# EAGLE design SparkFun_Interactive_Badge (EAGLE 7.2.0)
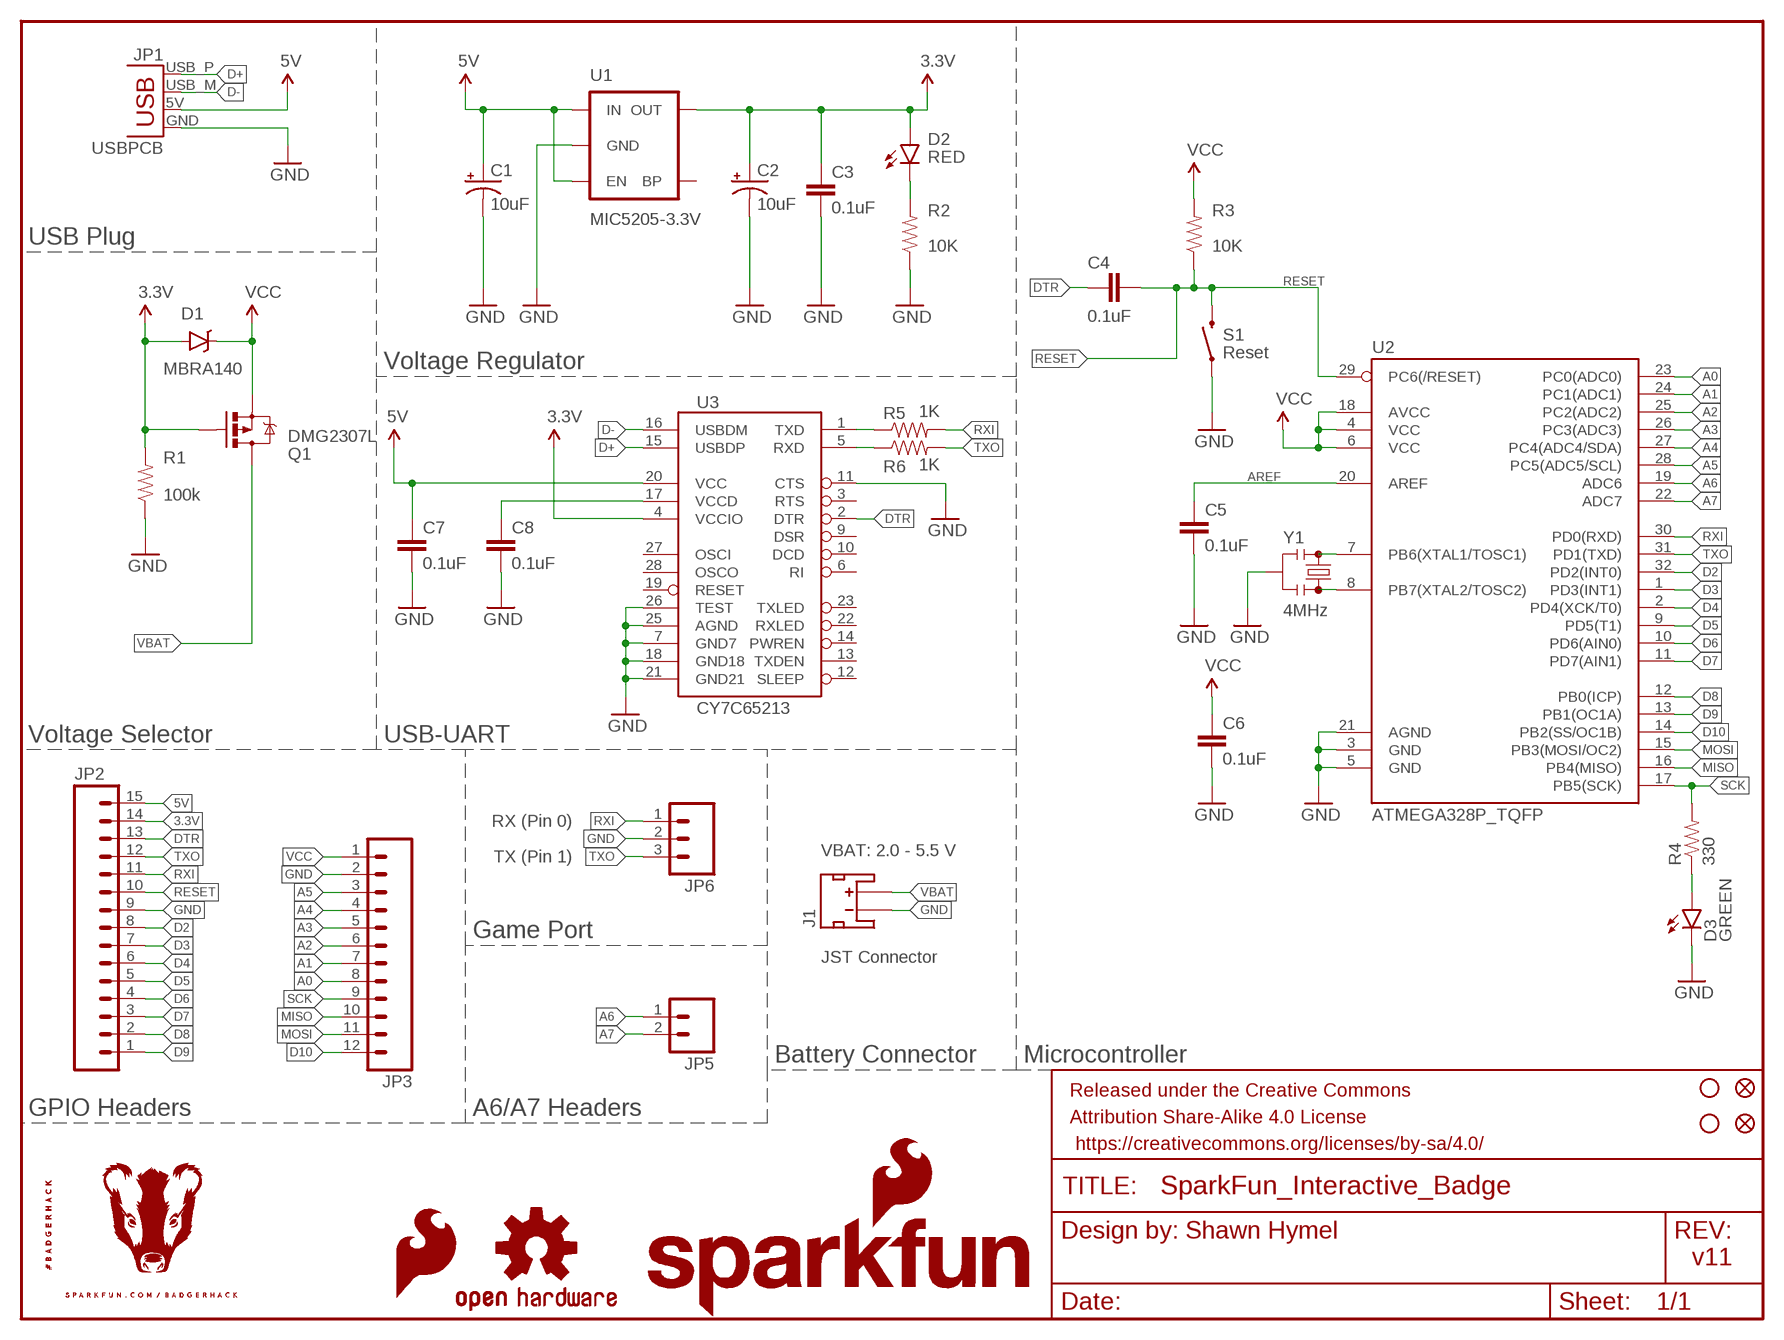
[diagram p0: schematic, sheet 1]

## Parts
C1  10uF  10UF-16V-10%(TANT)  [EIA3216]
C2  10uF  10UF-16V-10%(TANT)  [EIA3216]
C3  0.1uF  0.1UF-25V(+80/-20%)(0603)  [0603-CAP]
C4  0.1uF  0.1UF-25V(+80/-20%)(0603)  [0603-CAP]
C5  0.1uF  0.1UF-25V(+80/-20%)(0603)  [0603-CAP]
C6  0.1uF  0.1UF-25V(+80/-20%)(0603)  [0603-CAP]
C7  0.1uF  0.1UF-25V(+80/-20%)(0603)  [0603-CAP]
C8  0.1uF  0.1UF-25V(+80/-20%)(0603)  [0603-CAP]
D1  MBRA140  DIODE-SCHOTTKY-MBRA140  [SMA-DIODE]
D2  RED  LED-RED0603  [LED-0603]
D3  GREEN  LED-GREEN0603  [LED-0603]
FID1  FIDUCIAL1X2  [FIDUCIAL-1X2]
FID2  FIDUCIAL1X2  [FIDUCIAL-1X2]
FRAME1  FRAME-LETTER  [CREATIVE_COMMONS]
J1  JST_2MM_MALE  [JST-2-SMD]
JP1  USBPCB  [USB-A-PCB]
JP2  M15LOCK_NO_SILK  [1X15_LOCK_NO_SILK]
JP3  M12LOCK_NO_SILK  [1X12_LOCK_NO_SILK]
JP5  M021X02_NO_SILK  [1X02_NO_SILK]
JP6  M03LOCK Female  M03LOCK_NO_SILK  [1X03_LOCK_NO_SILK]
LOGO1  SFE_LOGO_FLAME.1_INCH  [SFE_LOGO_FLAME_.1]
LOGO2  OSHW-LOGOS  [OSHW-LOGO-S]
Q1  DMG2307L  MOSFET-PCHANNELDMG2307L  [SOT23-3]
R1  100k  100KOHM-1/10W-1%(0603)  [0603-RES]
R2  10K  10KOHM-1/10W-1%(0603)0603  [0603-RES]
R3  10K  10KOHM-1/10W-1%(0603)0603  [0603-RES]
R4  330  330OHM1/10W1%(0603)  [0603-RES]
R5  1K  1KOHM-1/10W-1%(0603)  [0603-RES]
R6  1K  1KOHM-1/10W-1%(0603)  [0603-RES]
S1  SWITCH-MOMENTARY-2SMD-REDUNDANT  [TACTILE-SWITCH-SMD]
STANDOFF1  STAND-OFF  [STAND-OFF]
STANDOFF2  STAND-OFF  [STAND-OFF]
U1  MIC5205-3.3V  MIC52053.3V  [SOT23-5]
U2  ATMEGA328P_TQFP  [TQFP32-08]
U3  CY7C65213  [SSOP28DB]
U$1  SFE_LOGO_NAME_FLAME.1_INCH  [SFE_LOGO_NAME_FLAME_.1]
U$2  BADGERHACK_LOGODUMMY  [DUMMY]
Y1  4MHz  RESONATOR4MHZ  [RESONATOR-SMD_MED]

## Nets
3.3V: C2.A(+) C3.1 D1.A D2.A JP2.14 Q1.1(G) R1.2 U1.5(OUT) U3.4(VCCIO)
5V: C1.A(+) C7.1 JP1.5V(VBUS) JP2.15 U1.1(IN) U1.3(EN) U3.20(VCC)
A0: JP3.8 U2.23(PC0(ADC0))
A1: JP3.7 U2.24(PC1(ADC1))
A2: JP3.6 U2.25(PC2(ADC2))
A3: JP3.5 U2.26(PC3(ADC3))
A4: JP3.4 U2.27(PC4(ADC4/SDA))
A5: JP3.3 U2.28(PC5(ADC5/SCL))
A6: JP5.1 U2.19(ADC6)
A7: JP5.2 U2.22(ADC7)
AREF: C5.1 U2.20(AREF)
D2: JP2.8 U2.32(PD2(INT0))
D3: JP2.7 U2.1(PD3(INT1))
D4: JP2.6 U2.2(PD4(XCK/T0))
D5: JP2.5 U2.9(PD5(T1))
D6: JP2.4 U2.10(PD6(AIN0))
D7: JP2.3 U2.11(PD7(AIN1))
D8: JP2.2 U2.12(PB0(ICP))
D9: JP2.1 U2.13(PB1(OC1A))
D10: JP3.12 U2.14(PB2(SS/OC1B))
D+: JP1.USB_P(D+) U3.15(USBDP)
D-: JP1.USB_M(D-) U3.16(USBDM)
DTR: C4.1 JP2.13 U3.2(DTR)
GND: C1.C(-) C2.C(-) C3.2 C5.2 C6.2 C7.2 C8.2 D3.C J1.1(-) JP1.GND JP2.9 JP3.2 JP6.2 R1.1 R2.1 S1.1 S1.2 U1.2(GND) U2.3(GND) U2.5(GND) U2.21(AGND) U3.7(GND7) U3.11(CTS) U3.18(GND18) U3.21(GND21) U3.25(AGND) U3.26(TEST) Y1.2
MISO: JP3.10 U2.16(PB4(MISO))
MOSI: JP3.11 U2.15(PB3(MOSI/OC2))
N$1: D3.A R4.1
N$2: C8.1 U3.17(VCCD)
N$3: R5.1 U3.1(TXD)
N$4: D2.C R2.2
N$5: U2.7(PB6(XTAL1/TOSC1)) Y1.1
N$6: U2.8(PB7(XTAL2/TOSC2)) Y1.3
N$7: R6.1 U3.5(RXD)
RESET: C4.2 JP2.10 R3.1 S1.3 S1.4 U2.29(PC6(/RESET))
RXI: JP2.11 JP6.1 R5.2 U2.30(PD0(RXD))
SCK: JP3.9 R4.2 U2.17(PB5(SCK))
TXO: JP2.12 JP6.3 R6.2 U2.31(PD1(TXD))
VBAT: J1.2(+) Q1.3(D)
VCC: C6.1 D1.C JP3.1 Q1.2(S) R3.2 U2.4(VCC) U2.6(VCC) U2.18(AVCC)
Unconnected: J1.NC1(PAD1) J1.NC2(PAD2) U1.4(BP) U3.3(RTS) U3.6(RI) U3.9(DSR) U3.10(DCD) U3.12(SLEEP) U3.13(TXDEN) U3.14(PWREN) U3.19(RESET) U3.22(RXLED) U3.23(TXLED) U3.27(OSCI) U3.28(OSCO)

## Notes on the sheet
- USB Plug
- Voltage Regulator
- Voltage Selector | USB-UART
- RX (Pin 0)
- TX (Pin 1) | VBAT: 2.0 - 5.5 V
- Game Port
- JST Connector
- Battery Connector | Microcontroller
- GPIO Headers | A6/A7 Headers

## Library data of the parts
C1 C2 = SparkFun-Capacitors:10UF-16V-10%(TANT): CAP-00811 1206/EIA-3216 Tantalum capacitor; PROD_ID: CAP-00811
C3-C8 = SparkFun-Capacitors:0.1UF-25V(+80/-20%)(0603): CAP-00810 Ceramic Standard decoupling cap; PROD_ID: CAP-00810
D1 = SparkFun-DiscreteSemi:DIODE-SCHOTTKY: Schottky diodes in SFE's production catalog BAT20J 1A 23V 0.62Vf RB751 120mA 40V 0.37Vf PMEG4005EJ 0.5A 40V 0.42Vf MBRA140 1A 40V 0.5Vf B340A 3A 40V SMA; PROD_ID: DIO-08053
D2 = SparkFun-LED:LED-RED: Assorted Red LEDs LilyPad 1206- DIO-09912 1206- DIO-00809 0603- DIO-00819 "SMART" means more efficient and expensive; PROD_ID: DIO-00819
D3 = SparkFun-LED:LED-GREEN: Various green LEDs Green LEDs used in SFE Production 0603- DIO-00821 LARGE- DIO-00862 LILYPAD- DIO-09910; PROD_ID: DIO-00821
FID1 FID2 = SparkFun-Aesthetics:FIDUCIAL: Fiducial Alignment Points Various fiducial points for machine vision alignment.
FRAME1 = SparkFun-Aesthetics:FRAME-LETTER: Schematic Frame Standard 8.5x11 US Letter frame; DESIGNER: Shawn Hymel; VERSION: v11
J1 = SparkFun-Connectors:JST_2MM_MALE: Mates to single-cell LiPo batteries. CONN-11443 Now with smashable polarity marks!; BTM_NEG: -; BTM_POS: +; PROD_ID: CONN-11443; TOP_NEG: -; TOP_POS: +
JP1 = SparkFun-Connectors:USB: USB Connectors USB-B-PTH is fully proven SKU : PRT-00139/CONN-08278 USB-miniB is fully proven SKU : PRT-00587 USB-A-PCB is untested. USB-A-H is throughly reviewed, but untested. Spark Fun Electronics SKU : PRT-00437 USB-B-SMT is throughly reviewed, but untested. Needs silkscreen touching up. USB-A-S has not been used/tested USB-MB-H has not been used/tested USB-MICROB has been used. CONN-09505
JP2 = SparkFun-Connectors:M15: Header 15 Standard 15-pin 0.1" header. Use with straight break away headers (SKU : PRT-00116), right angle break away headers (PRT-00553), swiss pins (PRT-00743), machine pins (PRT-00117), and female headers (PRT-00115).
JP3 = SparkFun-Connectors:M12: Header 12 Standard 12-pin 0.1" header. Use with straight break away headers (SKU : PRT-00116), right angle break away headers (PRT-00553), swiss pins (PRT-00743), machine pins (PRT-00117), and female headers (PRT-00115).
JP5 = SparkFun-Connectors:M02: Standard 2-pin 0.1" header. Use with - straight break away headers ( PRT-00116) - right angle break away headers (PRT-00553) - swiss pins (PRT-00743) - machine pins (PRT-00117) - female headers (PRT-00115) Molex polarized connector foot print use with: PRT-08233 with associated crimp pins and housings. 2.54_SCREWTERM for use with PRT-10571. 3.5mm Screw Terminal footprints for PRT-08084 5mm Screw Terminal footprints for use with PRT-08432
JP6 = SparkFun-Connectors:M03: Header 3 Standard 3-pin 0.1" header. Use with straight break away headers (SKU : PRT-00116), right angle break away headers (PRT-00553), swiss pins (PRT-00743), machine pins (PRT-00117), and female headers (PRT-00115). Molex polarized connector foot print use with SKU : PRT-08232 with associated crimp pins and housings.
LOGO1 = SparkFun-Aesthetics:SFE_LOGO_FLAME: SFE Logo, flame only This is the SparkFun flame logo. The logo on the schematic will always be the same size; the package variant is the height of the flame. Default layer for the logo on the board is tSilk.
LOGO2 = SparkFun-Aesthetics:OSHW-LOGO: Open Source Hardware Logo This logo indicates the piece of hardware it is found on incorporates a OSHW license and/or adheres to the definition of open source hardware found here: http://freedomdefined.org/OSHW
Q1 = SparkFun-DiscreteSemi:MOSFET-PCHANNEL: Generic PMOSFET IRLML2244 - TRANS-11153 (SOT-23 -20V -4.3A) (1.Gate 2.Source 3.Drain) FQP27P06 - COM-10349 <http://www.sparkfun.com/products/10349> (TO-220 -60V -27A) (1.Gate 2.Source 3.Drain); PROD_ID: TRANS-11308; VALUE: 2.5A/30V
R1 = SparkFun-Resistors:100KOHM-1/10W-1%(0603): RES-07828; PROD_ID: RES-07828
R2 R3 = SparkFun-Resistors:10KOHM-1/10W-1%(0603): RES-00824; PROD_ID: RES-00824
R4 = SparkFun-Resistors:330OHM1/10W1%(0603): RES-00818; PROD_ID: RES-00818
R5 R6 = SparkFun-Resistors:1KOHM-1/10W-1%(0603): RES-07856; PROD_ID: RES-07856
S1 = SparkFun-Electromechanical:SWITCH-MOMENTARY-2: Various NO switches- pushbuttons, reed, etc; FUNC: Reset; PROD_ID: SWCH-08247
STANDOFF1 STANDOFF2 = SparkFun-Electromechanical:STAND-OFF: #4 Stand Off This is the mechanical footprint for a #4 phillips button head screw. Use the keepout ring to avoid running the screw head into surrounding components. SKU : PRT-00447
U1 = SparkFun-PowerIC:MIC5205: MIC5205 150mA vreg 3.3V - VREG-00822 5V - VREG-00823; PROD_ID: VREG-00822
U2 = SparkFun-DigitalIC:ATMEGA328P_TQFP; PROD_ID: IC-09069
U3 = SparkFun-DigitalIC:CY7C65213: USB UART CY7C65213 USB-UART controller.; PROD_ID: IC-12487
U$1 = SparkFun-Aesthetics:SFE_LOGO_NAME_FLAME: SFE Logo, name and flame This is the SparkFun full logo. The logo on the schematic will always be the same size; the package variant is the height of the flame part of the logo. Default layer for the logo on the board is tSilk.
U$2 = SparkFun-Aesthetics:BADGERHACK_LOGO
Y1 = SparkFun-FreqCtrl:RESONATOR: Resonator Small SMD resonator. Used, eg, on the Arduino Pro/ Pro Mini boards. 8MHz- XTAL-08895 16MHz- XTAL-08900; PROD_ID: XTAL-12492

## Board
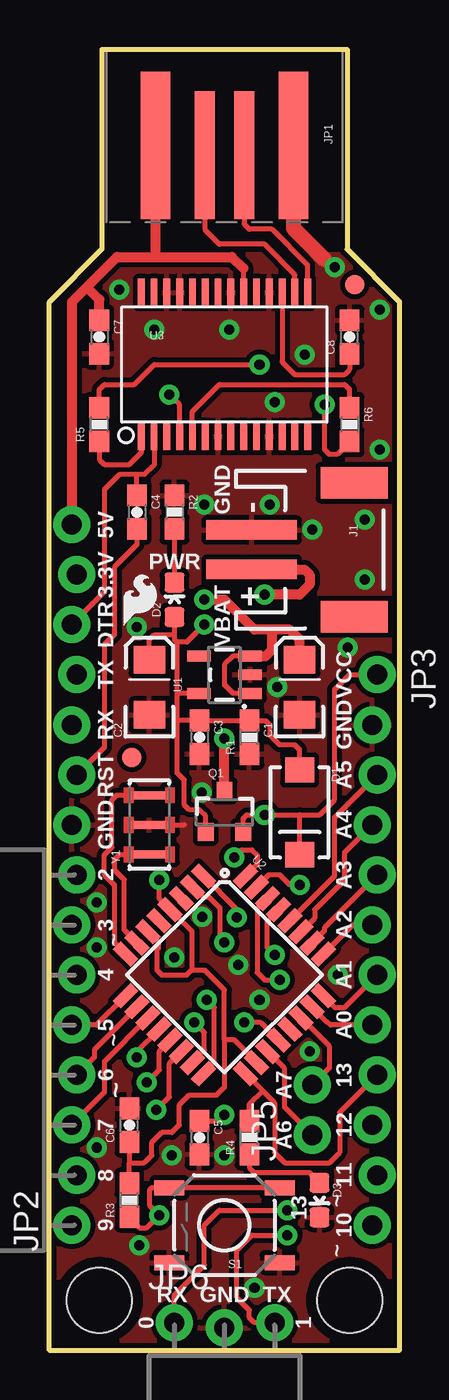
[diagram p1: board, top side]
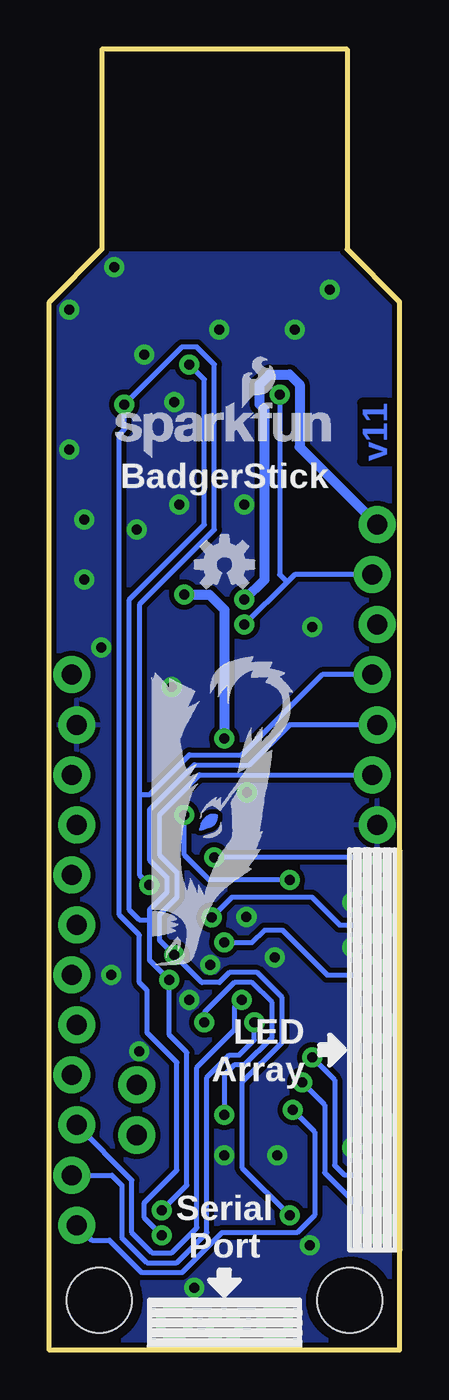
[diagram p2: board, bottom side, seen from below]

Size 17.78 x 66.04 mm. Coordinates in mm from the lower left corner, seen from the top.
Outline: 0,0 17.78,0 17.78,53.21 15.11,55.88 15.11,66.04 2.67,66.04 2.67,55.88 0,53.21 0,0
Copper layers (1*16): Top 0.035mm / dielectric 1.5mm / Bottom 0.035mm
Design rules "SparkFun-2-layer": minimum track width 7mil, minimum drill 15mil, track to track 8mil, track to pad 8mil, pad to pad 8mil, via to via 8mil, smd to smd 8mil, copper to edge 8mil, drill to drill 8mil, minimum pad ring 12mil, minimum via ring 10mil, stop-mask expansion 4mil, vias tented up to drill 20mil, thermal gap 10mil
tRestrict: 2 lines

### Footprints (pad centres in the part's own frame; a part is rotated, then mirrored left to right if it is on the bottom)
EIA3216 = smd 1.4 x 1.6: A 1.4,0; C -1.4,0
0603-CAP = smd 1.1 x 1: 1 -0.85,0; 2 0.85,0
SMA-DIODE = smd 1.27 x 1.47: A -2.15,0; C 2.15,0
LED-0603 = smd 1 x 1: A 0,-0.877; C 0,0.877
FIDUCIAL-1X2 = smd 1 x 1: 1 0,0
JST-2-SMD = smd 1 x 4.6: 1 -1,-3.7; 2 1,-3.7 | smd 1.6 x 3.4: NC1 -3.4,1.5; NC2 3.4,1.5
USB-A-PCB = smd 7.5 x 1.5: 5V -0.2,-3.5; GND -0.2,3.5 | smd 6.5 x 1: USB_M 0.3,-1; USB_P 0.3,1
1X15_LOCK_NO_SILK = drill 1.016 pad 1.88: 1 0,0.127; 2 2.54,-0.127; 3 5.08,0.127; 4 7.62,-0.127; 5 10.16,0.127; 6 12.7,-0.127; 7 15.24,0.127; 8 17.78,-0.127; 9 20.32,0.127; 10 22.86,-0.127; 11 25.4,0.127; 12 27.94,-0.127; 13 30.48,0.127; 14 33.02,-0.127; 15 35.56,0.127
1X12_LOCK_NO_SILK = drill 1.016 pad 1.88: 1 0,0.127; 2 2.54,-0.127; 3 5.08,0.127; 4 7.62,-0.127; 5 10.16,0.127; 6 12.7,-0.127; 7 15.24,0.127; 8 17.78,-0.127; 9 20.32,0.127; 10 22.86,-0.127; 11 25.4,0.127; 12 27.94,-0.127
1X02_NO_SILK = drill 1.016 pad 1.88: 1 0,0; 2 2.54,0
1X03_LOCK_NO_SILK = drill 1.016 pad 1.88: 1 0,0.127; 2 2.54,-0.127; 3 5.08,0.127
SOT23-3 = smd 0.8 x 0.9: 1 -0.95,-1; 2 0.95,-1; 3 0,1.1
0603-RES = smd 1.1 x 1: 1 -0.85,0; 2 0.85,0
TACTILE-SWITCH-SMD = smd 1.524 x 0.762: 1 -2.794,1.905; 2 2.794,1.905; 3 -2.794,-1.905; 4 2.794,-1.905
STAND-OFF = hole 3.302: 0,0
SOT23-5 = smd 0.55 x 1.2: 1 -0.95,-1.3; 2 0,-1.3; 3 0.95,-1.3; 4 0.95,1.3; 5 -0.95,1.3
TQFP32-08 = smd 1.27 x 0.559: 1 -4.293,2.8; 2 -4.293,2; 3 -4.293,1.2; 4 -4.293,0.4; 5 -4.293,-0.4; 6 -4.293,-1.2; 7 -4.293,-2; 8 -4.293,-2.8; 17 4.293,-2.8; 18 4.293,-2; 19 4.293,-1.2; 20 4.293,-0.4; 21 4.293,0.4; 22 4.293,1.2; 23 4.293,2; 24 4.293,2.8 | smd 0.559 x 1.27: 9 -2.8,-4.293; 10 -2,-4.293; 11 -1.2,-4.293; 12 -0.4,-4.293; 13 0.4,-4.293; 14 1.2,-4.293; 15 2,-4.293; 16 2.8,-4.293; 25 2.8,4.293; 26 2,4.293; 27 1.2,4.293; 28 0.4,4.293; 29 -0.4,4.293; 30 -1.2,4.293; 31 -2,4.293; 32 -2.8,4.293
SSOP28DB = smd 0.348 x 1.397: 1 -4.225,-3.656; 2 -3.575,-3.656; 3 -2.925,-3.656; 4 -2.275,-3.656; 5 -1.625,-3.656; 6 -0.975,-3.656; 7 -0.325,-3.656; 8 0.325,-3.656; 9 0.975,-3.656; 10 1.625,-3.656; 11 2.275,-3.656; 12 2.925,-3.656; 13 3.575,-3.656; 14 4.225,-3.656; 15 4.225,3.656; 16 3.575,3.656; 17 2.925,3.656; 18 2.275,3.656; 19 1.625,3.656; 20 0.975,3.656; 21 0.325,3.656; 22 -0.325,3.656; 23 -0.975,3.656; 24 -1.625,3.656; 25 -2.275,3.656; 26 -2.925,3.656; 27 -3.575,3.656; 28 -4.225,3.656
RESONATOR-SMD_MED = smd 0.4 x 1.6: 1 -1.5,0; 2 0,0; 3 1.5,0

### Placement (x,y rotation side)
C1  12.7,33.66 90 top
C2  5.08,33.66 90 top
C3  7.62,31.11 270 top
C4  4.45,42.55 270 top
C5  7.62,10.79 270 top
C6  4.06,11.43 90 top
C7  2.54,51.44 270 top
C8  15.24,51.44 90 top
D1  12.7,27.3 270 top
D2  6.35,38.1 0 top
D3  13.72,7.62 180 top
FID1  4.19,30.1 0 top
FID2  15.49,54.1 0 top
FRAME1  -19.05,-38.1 0 top  (outside the outline)
J1  13.97,40.64 270 top
JP1  8.89,60.96 270 top
JP2  1.27,6.35 90 top
JP3  16.51,34.29 270 top
JP5  13.34,10.92 90 top
JP6  6.35,1.27 0 top
LOGO1  3.45,36.45 0 top
LOGO2  8.89,39.88 0 bottom
Q1  8.89,27.3 0 top
R1  10.16,31.11 90 top
R2  6.35,42.55 270 top
R3  4.06,7.62 90 top
R4  10.16,10.79 90 top
R5  2.54,46.99 90 top
R6  15.24,46.99 270 top
S1  8.89,6.35 180 top
STANDOFF1  15.24,2.54 0 top
STANDOFF2  2.54,2.54 0 top
U1  8.89,34.29 90 top
U2  8.89,19.05 315 top
U3  8.89,50.04 0 top
U$1  14.86,45.21 0 bottom
U$2  -60.96,-31.75 0 top  (outside the outline)
U$3  [HALF_BADGER]  12.57,19.56 0 bottom
Y1  5.08,26.67 90 top

### Tracks (layer width: path | path; a pad name or v marks a point on that pad's centre or on a via)
3.3V  (via drill 0.51)
  Top 0.254: D1.A 12.7,30.48 12.45,30.73 11.68,30.73 11.18,31.24 11.18,31.75 10.96,31.96 R1.2 C3.1 6.52,31.96 6.48,32 | C2.A 5.08,36.07 5.33,36.32 6.35,36.32 | D2.A 6.35,36.32 | 6.35,36.32 6.35,36.07 6.48,35.94 | v7.87,36.83 6.99,35.94 6.48,35.94 | 6.48,35.94 6.48,33.27 | 6.48,33.27 6.48,32 | 6.48,32 6.48,29.34 6.86,28.96 6.86,27.69 7.11,27.43 7.62,27.43 7.94,27.11 Q1.1 | U1.5 6.54,33.34 6.48,33.27 | U3.4 6.62,47.99 v6.1,48.51
  Bottom 0.254: JP2.14 5.33,39.37 5.71,38.99 | 5.71,38.99 v7.87,36.83 | v6.1,48.51 6.1,39.37 5.71,38.99
5V  (via drill 0.51)
  Top 0.254: U3.20 9.87,54.91 | U1.1 9.33,33.34 8.89,33.78 8.89,34.8 9.33,35.24 U1.3
  Top 0.508: 1.91,53.98 1.14,53.21 JP2.15 | C7.1 2.54,53.34 1.91,53.98 | v7.87,38.1 8.89,38.1 10.41,36.58 11.43,36.58 | C1.A 12.7,36.07 12.19,36.58 11.43,36.58 | U1.3 10.98,35.24 11.3,35.56 11.3,36.45 11.43,36.58 | 1.91,53.98 3.43,55.5 5.33,55.5 | 5.33,55.5 9.27,55.5 9.87,54.91 | JP1.5V 5.39,55.55 5.33,55.5
  Bottom 0.508: v7.87,38.1 6.86,39.12 6.86,47.75 7.11,48.01 7.11,49.02 6.6,49.53 5.59,49.53 5.08,49.02 5.08,45.85 JP2.15
A0
  Top 0.254: U2.23 14.11,16.65 14.26,16.51 JP3.8
A1
  Top 0.254: JP3.7 14.99,17.4 14.48,17.4 13.9,17.97 U2.24
A2
  Top 0.254: U2.25 15.39,21.59 JP3.6
A3
  Top 0.254: U2.26 13.97,21.3 13.97,21.46 JP3.5
A4
  Top 0.254: U2.27 13.46,21.93 13.46,22.35 14.99,23.88 14.99,25.27 JP3.4
A5
  Top 0.254: U2.28 14.48,24.07 14.48,27.05 JP3.3
A6
  Top 0.254: U2.19 11.94,14.3 11.94,12.32 JP5.1
A7
  Top 0.254: U2.22 14.22,15.41 14.22,14.35 JP5.2
AREF  (via drill 0.51)
  Top 0.254: U2.20 10.74,16.64 v9.91,16.64 | C5.1 8.6,11.64 v8.89,11.94
  Bottom 0.254: v8.89,11.94 8.89,13.97 8.38,14.48 7.87,14.48 6.48,15.88 6.48,17.65 7.49,18.67 8.38,18.67 9.91,17.14 v9.91,16.64
D2  (via drill 0.51)
  Top 0.254: v9.4,25.02 9.78,25.4 10.29,25.4 10.54,25.15 10.54,24.66 U2.32
  Bottom 0.254: v9.4,25.02 2.29,25.02 JP2.8
D3  (via drill 0.51)
  Top 0.254: U2.1 9.53,22.38 v9.53,21.97
  Bottom 0.254: v9.53,21.97 8.51,22.99 4.45,22.99 3.05,21.59 JP2.7
D4  (via drill 0.51)
  Top 0.254: U2.2 7.31,23.5 7.8,23.01 8.1,23.01 8.66,22.45 8.66,20.93 v8.89,20.7
  Bottom 0.254: v8.89,20.7 7.49,20.7 6.86,21.34 5.97,21.34 3.68,19.05 JP2.6
D5
  Top 0.254: U2.9 2.39,16.51 JP2.5
D6
  Top 0.254: U2.10 4.44,17.39 2.29,15.24 2.29,14.86 JP2.4
D7
  Top 0.254: U2.11 2.79,14.65 2.79,13.08 JP2.3
D8  (via drill 0.51)
  Top 0.254: v4.45,14.86 4.45,15.17 U2.12
  Bottom 0.254: v4.45,14.86 3.3,13.72 3.3,9.4 2.79,8.89 JP2.2
D9  (via drill 0.51)
  Top 0.254: v4.95,13.59 5.59,14.22 5.59,15.18 U2.13
  Bottom 0.254: v4.95,13.59 3.81,12.45 3.81,9.02 JP2.1
D10  (via drill 0.51)
  Top 0.254: U2.14 6.1,14.56 6.1,12.85 v5.44,12.19
  Bottom 0.254: JP3.12 15.62,5.59 14.73,5.59 13.08,3.94 11.05,3.94 9.02,5.97 5.21,5.97 4.32,6.86 4.32,11.07 v5.44,12.19
D+
  Top 0.254: JP1.USB_P 9.89,57.17 10.16,56.9 11.3,56.9 13.12,55.08 U3.15
D-
  Top 0.254: JP1.USB_M 7.89,56.88 8.64,56.13 10.92,56.13 12.46,54.59 U3.16
DTR
  Top 0.254: JP2.13 2.79,38.48 2.79,43.69 3.56,44.45 4.45,44.45 | U3.2 5.32,44.94 4.83,44.45 4.45,44.45 | C4.1 4.45,44.45
GND  (via drill 0.51)
  Top 0.254: Y1.2 6.86,26.67
  Top 0.762: JP1.GND 12.39,56.95 13.97,55.37
  other vias: 7.77,22 6.35,19.94 9.6,19.56 10.67,17.78 14.63,19.05 8.89,9.91 6.22,9.91 2.41,22.73 2.41,20.45 7.75,28.32 11.56,33.66 7.87,42.93 13.34,41.66 14.48,54.99 16.76,52.83 12.95,50.55 3.56,53.85 9.14,51.82 11.43,48.13 16.76,45.72 16,39.12 4.45,36.7 11.18,42.93 5.33,51.82 10.41,3.17 13.21,15.16 2.41,10.29 4.57,5.33 16,42.16 15.14,35.66
  pour Top (isolate 0.254): 2.41,55.63 15.37,55.63 17.78,53.21 17.78,0 0,0 0,53.21
  pour Bottom (isolate 0.254): 2.41,55.63 15.37,55.63 17.78,53.21 17.78,0 0,0 0,53.21
MISO  (via drill 0.51)
  Top 0.254: U2.16 7.83,14.06 8.38,14.61 8.38,17.4 v8,17.78
  Bottom 0.254: JP3.10 13.59,8.64 13.59,5.97 12.57,4.95 11.56,4.95 10.29,6.22 10.29,14.35 8.38,16.26 8.38,17.4 v8,17.78
MOSI  (via drill 0.51)
  Top 0.254: U2.15 7.27,14.63 7.87,15.24 7.87,16.13 v7.37,16.64
  Bottom 0.254: v7.37,16.64 7.37,15.75 8.13,14.99 8.64,14.99 9.78,13.84 9.78,5.97 11.3,4.45 12.83,4.45 14.1,5.71 14.1,8.38 14.61,8.89 JP3.11
N$1
  Top 0.254: R4.1 10.16,9.27 10.41,9.02 13.21,9.02 D3.A
N$2
  Top 0.254: U3.17 11.81,50.16 12.45,49.53 14.99,49.53 15.24,49.78 C8.1
N$3
  Top 0.254: U3.1 4.67,45.56 4.06,44.96 2.79,44.96 2.54,45.21 R5.1
N$4
  Top 0.254: R2.2 D2.C
N$5
  Top 0.254: U2.7 4.44,20.71 3.81,21.34 3.81,23.88 3.3,24.38 3.3,24.89 3.58,25.17 Y1.1
N$6
  Top 0.254: U2.8 3.88,20.13 3.3,20.7 3.3,23.62 2.79,24.13 2.79,25.15 3.17,25.53 3.17,27.94 3.4,28.17 Y1.3
N$7
  Top 0.254: U3.5 7.26,47.65 8.64,49.02 14.99,49.02 15.24,48.77 R6.1
RESET  (via drill 0.51)
  Top 0.254: v11.43,20.07 11.05,20.45 11.05,21.77 U2.29 | S1.3 S1.4 5.21,8.26 5.08,8.13 5.08,7.37 v5.59,6.86 4.95,6.22 4.57,6.22 4.06,6.73 R3.1 | JP2.10 2.79,30.61 2.79,35.81 3.3,36.32 3.3,39.75 4.45,40.89 C4.2
  Bottom 0.254: JP2.10 10.16,29.21 12.19,27.18 12.19,25.15 11.3,24.26 11.3,22.99 12.19,22.1 12.19,20.83 v11.43,20.07 10.03,18.67 9.14,18.67 8.64,19.18 7.24,19.18 5.97,17.91 5.97,15.62 8,13.59 8,9.27 v5.59,6.86
RXI  (via drill 0.51)
  Top 0.254: U2.30 10.54,22.4 10.54,19.18 10.92,18.8 v11.68,18.8 | R5.2 2.54,48.77 2.79,49.02 4.32,49.02 5.33,50.04 v10.67,50.04 | JP6.1 6.35,2.79 7.87,4.32 7.87,6.35 8.64,7.11 v12.06,7.11
  Bottom 0.254: JP2.11 5.59,31.75 7.62,29.72 10.41,29.72 12.7,27.43 12.7,24.89 11.81,24 11.81,23.24 12.7,22.35 12.7,21.84 | v10.67,50.04 9.91,49.28 9.91,41.91 13.72,38.1 13.72,22.35 13.21,21.84 12.7,21.84 | v12.06,7.11 10.79,8.38 10.79,15.11 11.68,16 v11.68,18.8 12.7,19.81 12.7,21.84
SCK
  Top 0.254: R4.2 10.16,12.5 10.82,13.16 | 10.82,13.16 11.43,12.55 11.43,10.03 11.94,9.53 14.22,9.53 14.73,10.03 14.73,12.06 JP3.9 | 10.82,13.16 U2.17
TXO  (via drill 0.51)
  Top 0.254: v12.7,23.62 12.19,23.62 11.68,24.13 11.14,24.13 U2.31 | R6.2 15.24,46.1 14.61,45.47 14.22,45.47 13.97,45.72 v13.97,48.01 | JP6.3 10.41,1.4 10.16,1.65 10.16,2.03 9.53,2.67 9.53,5.08 10.29,5.84 v12.06,5.84
  Bottom 0.254: v12.7,23.62 13.21,24.13 13.21,28.19 | JP2.12 3.94,34.29 8,30.23 10.67,30.23 12.7,28.19 13.21,28.19 | 13.21,28.19 13.21,37.85 9.4,41.66 9.4,50.04 10.29,50.93 11.05,50.93 v13.97,48.01 13.97,46.74 14.22,46.48 14.22,22.1 13.21,21.08 13.21,18.67 12.83,18.29 12.83,16.13 11.3,14.61 11.3,9.14 12.95,7.49 12.95,6.73 v12.06,5.84
VBAT  (via drill 0.51)
  Top 0.254: 10.29,39.62 J1.2
  Top 0.508: 10.29,39.62 12.95,39.62 13.21,39.37 13.21,38.86 12.7,38.35 v10.92,38.35 | Q1.3 v8.89,31.06
  Bottom 0.508: v10.92,38.35 9.65,38.35 8.89,37.59 v8.89,31.06
VCC  (via drill 0.51)
  Top 0.254: 7.24,19.3 7.24,21.27 U2.4 5.59,22.92 v5.59,23.88 | 7.24,19.3 7.87,19.3 8.89,18.29 8.89,15.75 | 8.89,15.75 9.4,15.75 10.51,14.63 U2.18 | R3.2 4.06,9.53 | 4.06,9.53 4.83,9.53 5.21,9.91 5.21,10.54 5.71,11.05 6.22,11.05 6.6,11.43 6.6,12.45 7.11,12.95 8.51,12.95 8.89,13.34 8.89,15.75 | C6.1 4.06,9.53 | 7.24,19.3 6.99,19.05 5.71,19.05 5.46,19.3 5.46,20.32 5.54,20.4 5.54,20.73 5.13,21.13 5.03,21.24 U2.6 | Q1.2 9.84,26.98 10.03,27.18 v10.92,27.18 12.7,27.18 | 12.7,27.18 13.72,27.18 14.48,27.94 14.48,33.53 15.24,34.29 JP3.1 | D1.C 12.7,27.18
  Bottom 0.254: v5.59,23.88 9.65,23.88 10.92,25.15 v10.92,27.18

### Text on the board
tPlace: 5V | GND | PWR | 3.3V | VBAT | DTR | TX | VCC | RX | GND | RST | A5 | GND | A4 | 2 | A3 | 3 | A2 | ~ | 4 | A1 | 5 | A0 | ~ | 6 | 13 | ~ | A7 | 7 | A6 | 12 | 8 | 11 | ~ | 13 | 9 | 10 | ~ | RX | GND | TX | 0 | 1
bPlace: BadgerStick | LED / Array | Serial / Port
Measures: 0.13 | All measurements in inches